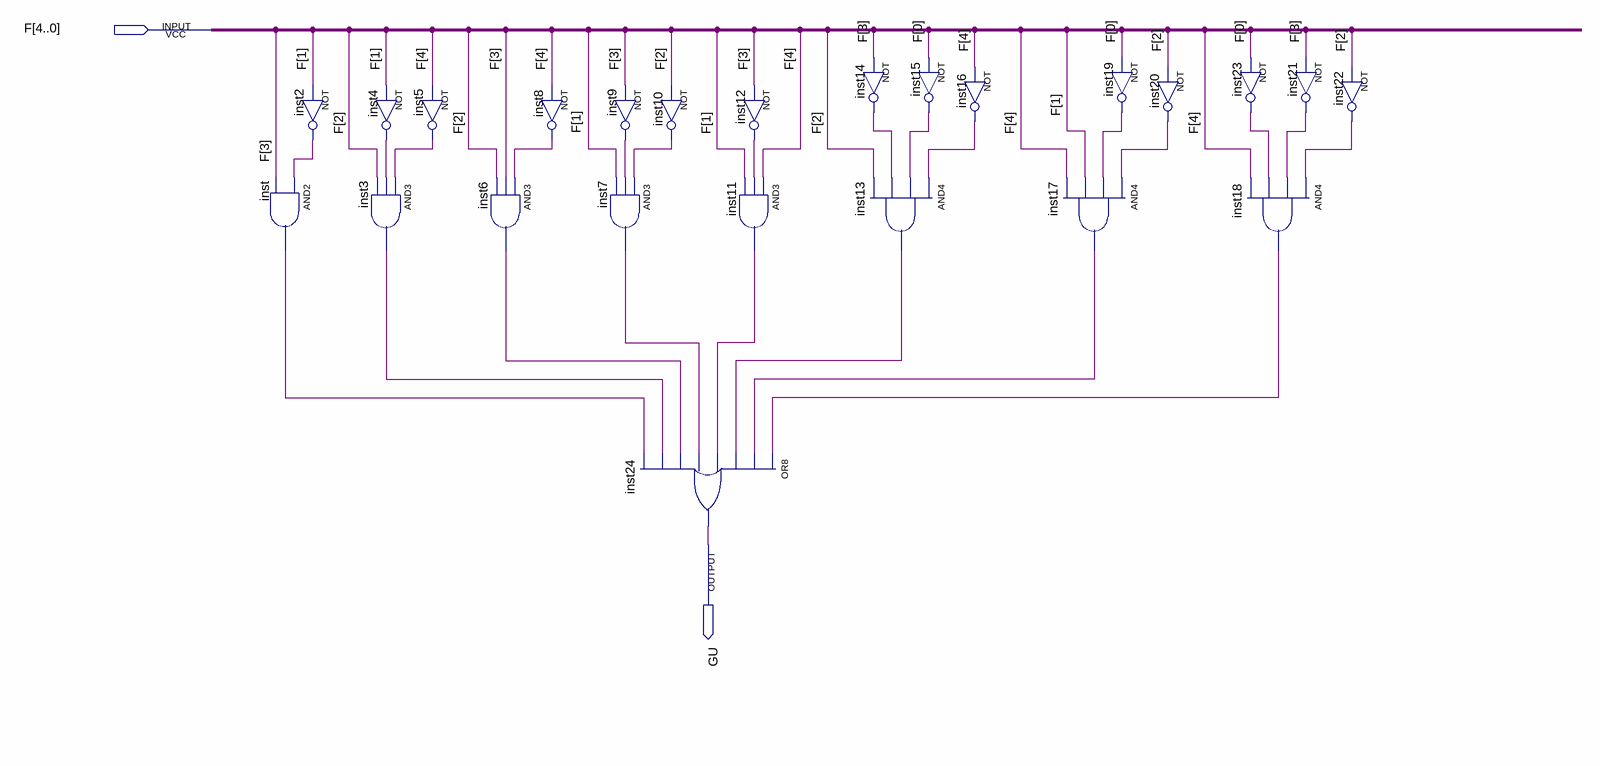
[diagram p0: schematic sheet]
// Quartus schematic GU.bdf as structural Verilog: 24 symbols, 2 pins
module GU (
  input  [4:0] F,
  output GU
);

  wire inst2_out, inst3_out, inst4_out, inst5_out, inst6_out, inst7_out, inst8_out, inst9_out, inst10_out,
       inst11_out, inst12_out, inst13_out, inst14_out, inst15_out, inst16_out, inst17_out, inst18_out,
       inst19_out, inst20_out, inst21_out, inst22_out, inst23_out, inst_out;

  and inst (inst_out, inst2_out, F[3]);
  not inst2 (inst2_out, F[1]);
  not inst4 (inst4_out, F[1]);
  and inst3 (inst3_out, inst5_out, inst4_out, F[2]);
  not inst5 (inst5_out, F[4]);
  and inst6 (inst6_out, inst8_out, F[3], F[2]);
  not inst8 (inst8_out, F[4]);
  not inst9 (inst9_out, F[3]);
  and inst7 (inst7_out, inst10_out, inst9_out, F[1]);
  or inst24 (GU, inst18_out, inst17_out, inst13_out, inst11_out, inst7_out, inst6_out, inst3_out, inst_out);
  not inst10 (inst10_out, F[2]);
  not inst12 (inst12_out, F[3]);
  and inst11 (inst11_out, F[4], inst12_out, F[1]);
  not inst14 (inst14_out, F[3]);
  not inst15 (inst15_out, F[0]);
  and inst13 (inst13_out, inst16_out, inst15_out, inst14_out, F[2]);
  not inst16 (inst16_out, F[4]);
  and inst17 (inst17_out, inst20_out, inst19_out, F[1], F[4]);
  not inst19 (inst19_out, F[0]);
  not inst20 (inst20_out, F[2]);
  not inst21 (inst21_out, F[3]);
  not inst23 (inst23_out, F[0]);
  and inst18 (inst18_out, inst22_out, inst21_out, inst23_out, F[4]);
  not inst22 (inst22_out, F[2]);
endmodule
